# Altium schematic sheet USB SPI I2C.SchDoc
size A3
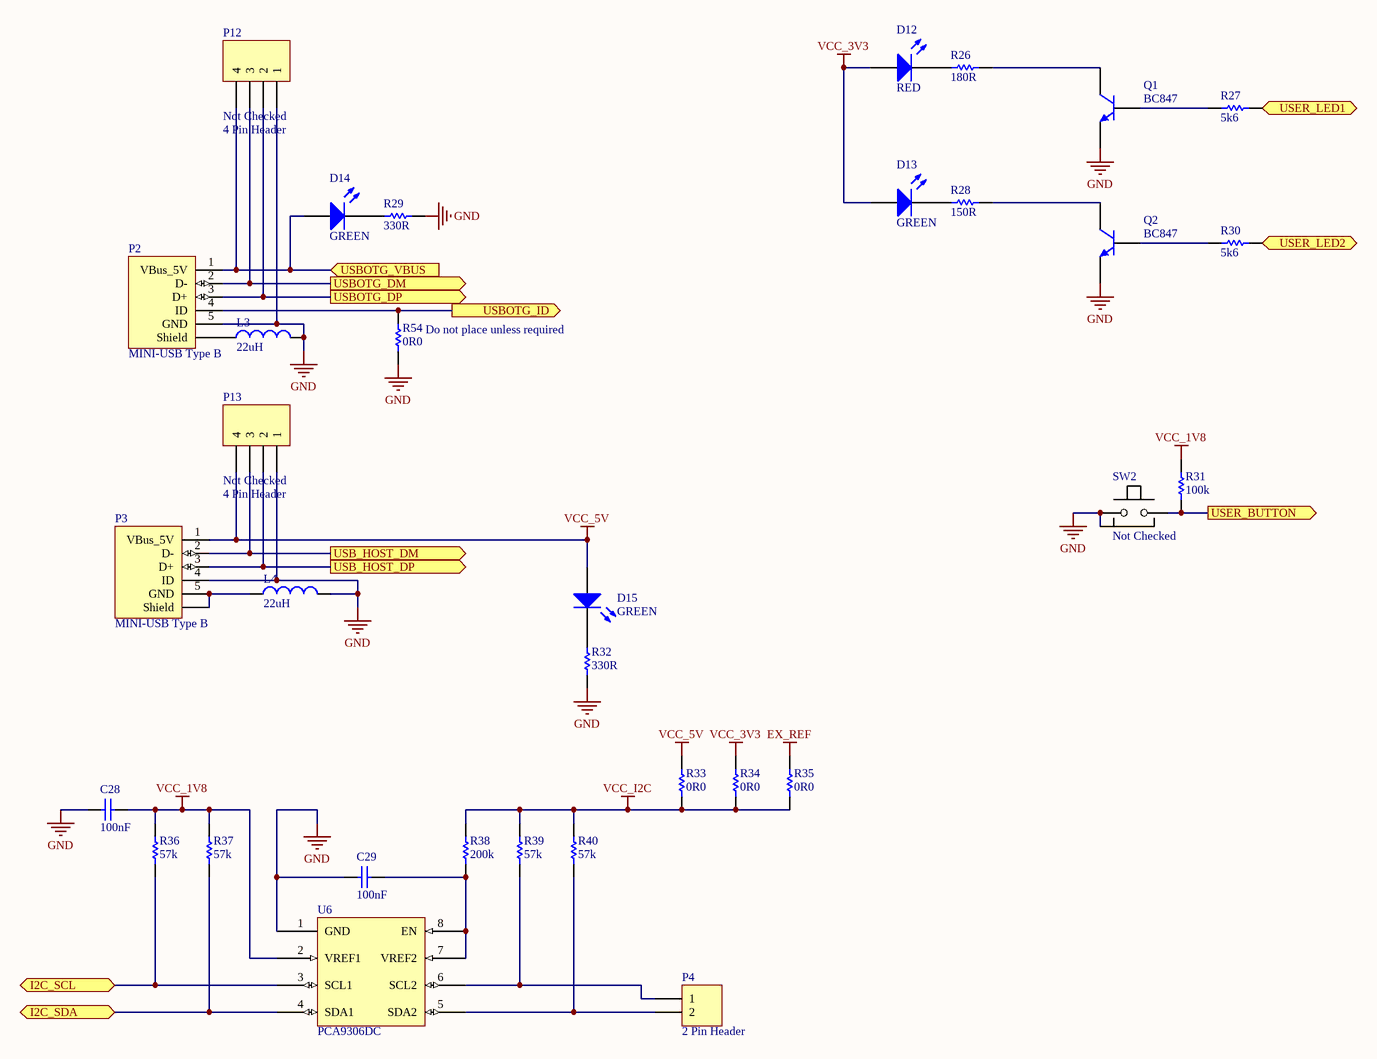
[diagram p0: USB SPI I2C.SchDoc]

## Parts
C28  100nF  [0603]
C29  100nF  [0603]
D12  value RED  [Diode_0805]  (hidden comment: LED Red)
D13  value GREEN  [Diode_0805]  (hidden comment: LED Green)
D14  value GREEN  [Diode_0805]  (hidden comment: LED Green)
D15  value GREEN  [Diode_0805]  (hidden comment: LED Green)
L3  22uH  [0805]
L4  22uH  [0805]
P2  MINI-USB Type B  [Hir_MINI_USB_B]
P3  MINI-USB Type B  [Hir_MINI_USB_B]
P4  2 Pin Header  [CONN_2X1_SMT_RA_1.25MM]
P12  Verify: Not Checked  [CONN_4X1_SMT_RA_1.25MM]  (hidden comment: 4 Pin Header)
P13  Verify: Not Checked  [CONN_4X1_SMT_RA_1.25MM]  (hidden comment: 4 Pin Header)
Q1  BC847  [SOT23]
Q2  BC847  [SOT23]
R26  180R  [0603]
R27  5k6  [0603]
R28  150R  [0603]
R29  330R  [0603]
R30  5k6  [0603]
R31  100k  [0603]
R32  330R  [0603]
R33  0R0  [0603]  (no BOM)
R34  0R0  [0603]  (no BOM)
R35  0R0  [0603]  (no BOM)
R36  57k  [0603]
R37  57k  [0603]
R38  200k  [0603]
R39  57k  [0603]
R40  57k  [0603]
R54  0R0  [0603]  (no BOM)
SW2  Verify: Not Checked  [PUSHBUTTON_B3U]  (hidden comment: Push Button Switch)
U6  PCA9306DC  [VSSOP-8]

## Ports
I2C_SCL (bidir), I2C_SDA (bidir), USB_HOST_DM (out), USB_HOST_DP (out), USBOTG_DM (out), USBOTG_DP (out), USBOTG_ID (out), USBOTG_VBUS (in), USER_BUTTON (out), USER_LED1 (in), USER_LED2 (in)

## Nets
EX_REF: R35.1
GND: C28.2 C29.2 L3.2 L4.2 P2.5(GND) P3.4(ID) P12.1 P13.1 Q1.2(E) Q2.2(E) R29.2 R32.1 R54.2 SW2.1 SW2.3(GND) U6.1(GND)
VCC_1V8: C28.1 R31.1 R36.2 R37.2 U6.2(VREF1)
VCC_3V3: D12.1(A) D13.1(A) R34.1
VCC_5V: D15.1(A) P3.1(VBus_5V) P13.4 R33.1
VCC_I2C: R33.2 R34.2 R35.2 R38.2 R39.2 R40.2
I2C_SCL: R36.1 U6.3(SCL1) ; port I2C_SCL
I2C_SDA: R37.1 U6.4(SDA1) ; port I2C_SDA
USB_HOST_DM: P3.2(D-) P13.3 ; port USB_HOST_DM
USB_HOST_DP: P3.3(D+) P13.2 ; port USB_HOST_DP
USBOTG_DM: P2.2(D-) P12.3 ; port USBOTG_DM
USBOTG_DP: P2.3(D+) P12.2 ; port USBOTG_DP
USBOTG_ID: P2.4(ID) R54.1 ; port USBOTG_ID
USBOTG_VBUS: D14.1(A) P2.1(VBus_5V) P12.4 ; port USBOTG_VBUS
USER_BUTTON: R31.2 SW2.2 ; port USER_BUTTON
USER_LED1: R27.2 ; port USER_LED1
USER_LED2: R30.2 ; port USER_LED2
NetC29_1: C29.1 R38.1 U6.7(VREF2) U6.8(EN)
NetD12_2: D12.2(K) R26.1
NetD13_2: D13.2(K) R28.1
NetD14_2: D14.2(K) R29.1
NetD15_2: D15.2(K) R32.2
NetL3_1: L3.1 P2.6(Shield)
NetL4_1: L4.1 P3.5(GND) P3.6(Shield)
NetP4_1: P4.1 R39.1 U6.6(SCL2)
NetP4_2: P4.2 R40.1 U6.5(SDA2)
NetQ1_1: Q1.1(B) R27.1
NetQ1_3: Q1.3(C) R26.2
NetQ2_1: Q2.1(B) R30.1
NetQ2_3: Q2.3(C) R28.2

## Notes on the sheet
- (near R54) Do not place unless required

## Library data of the parts
C28 C29 = CP_100nF 0603: CAP CER .10UF 50V X5R 0603; Manufacturer: Taiyo Yuden; Manufacturer PN: UMK107B7104KA-T; Prototype: Digikey 587-1243-1-ND; LatestRevisionDate: 29 May 08; Value: 100nF
D12 = DL_LED Red 0805: Red LED 0805; Manufacturer PN: TLMS2100-GS08; Manufacturer: Vishay; Prototype: Digikey 751-1183-1-ND
D13-D15 = DL_LED Green 0805: Green LED 0805; Prototype: Digikey 751-1166-1-ND; Verify: Not checked; DigiKey: TLMG2100-GS08; Category: Vishay
L3 L4 = IN_22uH 100mA 0805: Inductor 22uH 100mA 10% 0805; Manufacturer PN: GLF2012T220K; Manufacturer: TDK Corporation; Prototype: Digikey 445-3160-1-ND; LatestRevisionDate: 29 May 08; Value: 22uH
P2 P3 = JP_MINIUSB type B_1: MINI-USB Type B Single Connector; Manufacturer PN: UX60-MB-5ST; Manufacturer: Hirose Electric Co Ltd; Prototype: Digikey H2959CT-ND; LatestRevisionDate: 29 May 08; Value: MINI-USB Type B
P4 = JP_2PIN HDR_SMT_RA_MOLEX: CONN HDR VERT 2POS .100" SNGL; LatestRevisionDate: 24 Jun 08; Value: 2 Pin Header
P12 P13 = JP_4PIN HDR_SMT_RA_MOLEX: CONN HDR VERT 4POS .100" SNGL; Manufacturer: Molex; Manufacturer PN: 53261-0471; Prototype: Digikey WM7622CT-ND; LatestRevisionDate: 24 Jun 08; Value: 4 Pin Header
Q1 Q2 = TN_BC847: TRANS NPN GP 100MA 45V SOT23; Manufacturer: NXP Semiconductors; Manufacturer PN: BC847C T/R; Prototype: Digikey 568-1636-2-ND; LatestRevisionDate: 2  Jun 08; Value: BC847
R26 = RS_180R 0603: RES 180OHM 1/10W 1% 0603 SMD; Manufacturer: Panasonic - ECG; Manufacturer PN: ERJ-3EKF1800V; Prototype: DigiKey P180HCT-ND; LatestRevisionDate: 25 June 2009; Value: 180R
R27 R30 = RS_5k6 0603: RES 5.6K OHM 1/10W 5% 0603 SMD; Manufacturer: Yageo; Manufacturer PN: RC0603JR-075K6L; Prototype: DigiKey 311-5.6KGRCT-ND; LatestRevisionDate: 1 Jun 08; Value: 5k6
R28 = RS_150R 0603: RES 150 OHM 1/10W 1% 0603 SMD; Manufacturer: ROHM; Manufacturer PN: MCR03EZPFX1500; Prototype: DigiKey RHM150HCT-ND; LatestRevisionDate: 4th July 08; Value: 150R
R29 = RS_330R 0603: RES 330 OHM 1/10W 1% 0603 SMD; Manufacturer: Yageo; Manufacturer PN: RC0603FR-07330RL; Prototype: DigiKey 311-330HRCT-ND; LatestRevisionDate: 25 June 2009; Value: 330R
R31 R32 = RS_100k 0603: RES 100K OHM 1/10W 1% 0603 SMD; Manufacturer: Yageo; Manufacturer PN: RC0603FR-07100KL; Prototype: DigiKey 311-100KHRCT-ND; LatestRevisionDate: 1 Jun 08
  R31: Value: 100k
  R32: Value: 330R
R33-R35 R54 = RS_0R0 0603: RES 0.0 OHM 1/10W 5% 0603 SMD; Manufacturer: Rohm; Manufacturer PN: MCR03EZPJ000; Prototype: DigiKey RHM0.0GCT-ND; LatestRevisionDate: 3 Jun 08; Value: 0R0
R36-R40 = RS_10k 0603_1: RES 10.0K OHM 1/10W 1% 0603 SMD; Manufacturer: Yageo; Manufacturer PN: RC0603FR-0710KL; Prototype: DigiKey 311-10.0KHRCT-ND; LatestRevisionDate: 29 May 08
  R36 R37 R39 R40: Value: 57k
  R38: Value: 200k
SW2 = SW_TACT 3MM RT: SWITCH TACT RT ANG SPST SMD; Manufacturer: Omron; Manufacturer PN: B3U-3100P; Prototype: SW1023CT-ND; LatestRevisionDate: 22 Jun 08; Value: Push Button Switch
U6 = IC_PCA9306DC: IC LEVEL TRANSLATOR I2C BUS 8VSSOP; Manufacturer: NXP Semiconductor; Prototype: DigiKey 568-4213-1-ND; Manufacturer PN: PCA9306DC; LatestRevisionDate: 29 May 08; Value: PCA9306DC